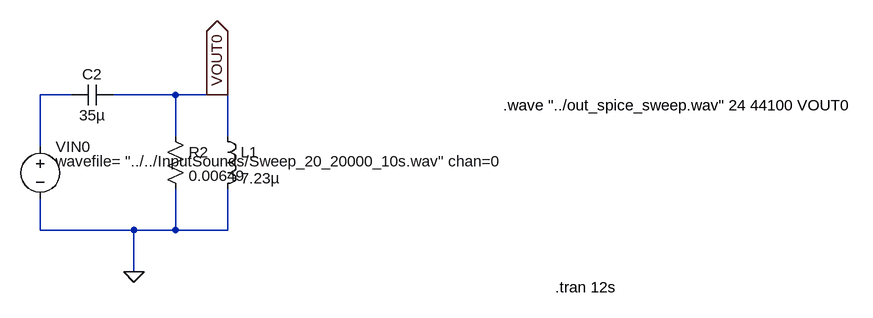
[diagram p0: schematic RLCHighpassFilter.asc]
RLCHighpassFilter.asc, the LTspice schematic file:
Version 4
SHEET 1 2240 784
WIRE 48 304 0 304
WIRE 208 304 112 304
WIRE 272 304 208 304
WIRE 288 304 272 304
WIRE 208 368 208 304
WIRE 288 368 288 304
WIRE 0 384 0 304
WIRE 0 512 0 464
WIRE 144 512 0 512
WIRE 208 512 208 448
WIRE 208 512 144 512
WIRE 288 512 288 448
WIRE 288 512 208 512
WIRE 144 576 144 512
FLAG 144 576 0
FLAG 272 304 VOUT0
IOPIN 272 304 Out
SYMBOL cap 112 288 R90
WINDOW 0 0 32 VBottom 2
WINDOW 3 32 32 VTop 2
SYMATTR InstName C2
SYMATTR Value 35µ
SYMBOL res 192 352 R0
SYMATTR InstName R2
SYMATTR Value 0.00649
SYMBOL voltage 0 368 R0
WINDOW 3 24 38 Left 2
SYMATTR Value wavefile= "../../InputSounds/Sweep_20_20000_10s.wav" chan=0
SYMATTR InstName VIN0
SYMBOL /ind 272 352 R0
SYMATTR InstName L1
SYMATTR Value 7.23µ
TEXT 712 320 Left 2 !.wave "../out_spice_sweep.wav" 24 44100 VOUT0
TEXT 792 600 Left 2 !.tran 12s

The netlist it stands for:
* RLCHighpassFilter.asc
C2 VOUT0 N001 35µ
R2 VOUT0 0 0.00649
VIN0 N001 0 wavefile= "../../InputSounds/Sweep_20_20000_10s.wav" chan=0
L1 VOUT0 0 7.23µ
.wave "../out_spice_sweep.wav" 24 44100 VOUT0
.tran 12s
.backanno
.end